# EAGLE design SignalGenerator (EAGLE 7.6.0)
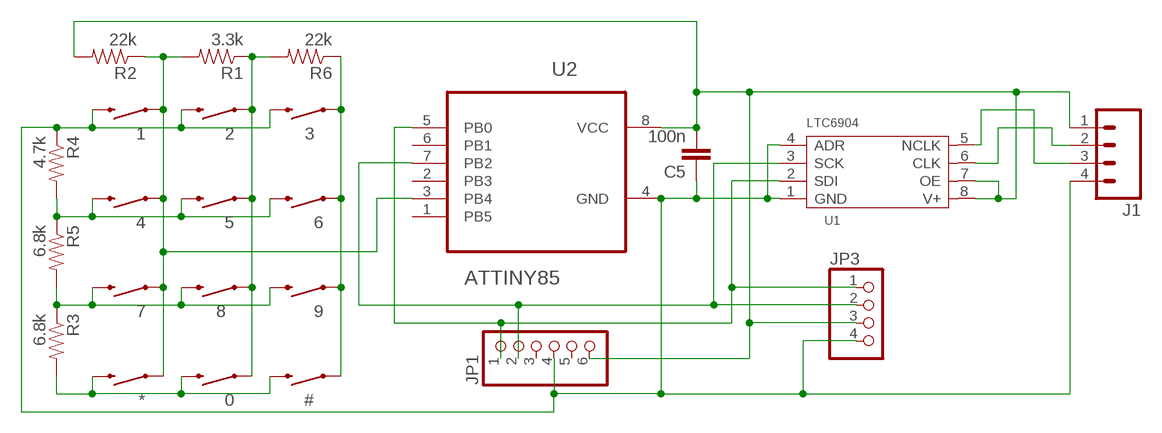
[diagram p0: schematic, sheet 1]

## Parts
0  SWITCH-MOMENTARY-2PTH  [TACTILE-PTH]
1  SWITCH-MOMENTARY-2PTH  [TACTILE-PTH]
2  SWITCH-MOMENTARY-2PTH  [TACTILE-PTH]
3  SWITCH-MOMENTARY-2PTH  [TACTILE-PTH]
4  SWITCH-MOMENTARY-2PTH  [TACTILE-PTH]
5  SWITCH-MOMENTARY-2PTH  [TACTILE-PTH]
6  SWITCH-MOMENTARY-2PTH  [TACTILE-PTH]
7  SWITCH-MOMENTARY-2PTH  [TACTILE-PTH]
8  SWITCH-MOMENTARY-2PTH  [TACTILE-PTH]
9  SWITCH-MOMENTARY-2PTH  [TACTILE-PTH]
#  SWITCH-MOMENTARY-2PTH  [TACTILE-PTH]
*  SWITCH-MOMENTARY-2PTH  [TACTILE-PTH]
C5  100n  CAP0603-CAP  [0603-CAP]
J1  M04SMD_RA_FEMALE  [1X04_SMD_RA_FEMALE]
JP1  HEADER-1X6ROUND  [1X06_ROUND]
JP3  HEADER-1X4ROUND  [1X04_ROUND]
R1  3.3k  0.3OHM-1/8W-1%(0805)  [0805]
R2  22k  0.3OHM-1/8W-1%(0805)  [0805]
R3  6.8k  0.3OHM-1/8W-1%(0805)  [0805]
R4  4.7k  0.3OHM-1/8W-1%(0805)  [0805]
R5  6.8k  0.3OHM-1/8W-1%(0805)  [0805]
R6  22k  0.3OHM-1/8W-1%(0805)  [0805]
U1  LTC6904  AMPLIFIER-INA331DGK(MSOP8)  [MSOP8-0.65-3X3MM]
U2  ATTINY85  ATTINY85-20SU  [SOIC127P798X216-8N]

## Nets
GND: 1.3 2.3 3.3 C5.1 J1.4 JP1.4 JP3.4 R4.1 U1.1(GND) U1.4(ADR) U2.4(GND)
N$1: J1.3 U1.5(NCLK)
N$2: JP1.2 JP3.2 U1.3(SCK) U2.7(PB2)
N$3: J1.2 U1.6(CLK)
N$4: 0.3 #.3 *.3 R3.2
N$6: 4.3 5.3 6.3 R4.2 R5.1
N$7: 7.3 8.3 9.3 R3.1 R5.2
N$8: 1.1 4.1 7.1 *.1 R1.2 R2.1 U2.3(PB4)
N$9: JP1.1 JP3.1 U1.2(SDI) U2.5(PB0)
N$12: 0.1 2.1 5.1 8.1 R1.1 R6.2
N$13: 3.1 6.1 9.1 #.1 R6.1
V+: C5.2 J1.1 JP1.6 JP3.3 R2.2 U1.7(OE) U1.8(V+) U2.8(VCC)
Unconnected: JP1.3 JP1.5 U2.1(PB5) U2.2(PB3) U2.6(PB1)

## Library data of the parts
0 1-9 # * = SparkFun-Electromechanical:SWITCH-MOMENTARY-2: Various NO switches- pushbuttons, reed, etc; PROD_ID: SWCH-08441
C5 = SparkFun-Capacitors:CAP: Capacitor Standard 0603 ceramic capacitor, and 0.1" leaded capacitor.
J1 = SparkFun-Connectors:M04: Header 4 Standard 4-pin 0.1" header. Use with straight break away headers (SKU : PRT-00116), right angle break away headers (PRT-00553), swiss pins (PRT-00743), machine pins (PRT-00117), and female headers (PRT-00115). Molex polarized connector foot print use with SKU : PRT-08231 with associated crimp pins and housings. 1MM SMD Version SKU: PRT-10208
JP1 = microbuilder:HEADER-1X6: PIN HEADER
JP3 = microbuilder:HEADER-1X4: PIN HEADER
R1-R6 = SparkFun-Resistors:0.3OHM-1/8W-1%(0805): RES-11622; PROD_ID: RES-11622; VALUE: 0.3
U1 = technoblogy:AMPLIFIER-INA331DGK(MSOP8): 310020014; MPN: INA331IDGK; VALUE: INA331IDGK-MSOP8
U2 = Atmel_By_element14_Batch_1-00:ATTINY85-20SU: 8-bit Microcontroller with In-System Programmable Flash; MPN: ATTINY85-20SU; OC_FARNELL: 1455164; OC_NEWARK: 58M3797; PACKAGE: SOIC-8; SUPPLIER: Atmel

## Board
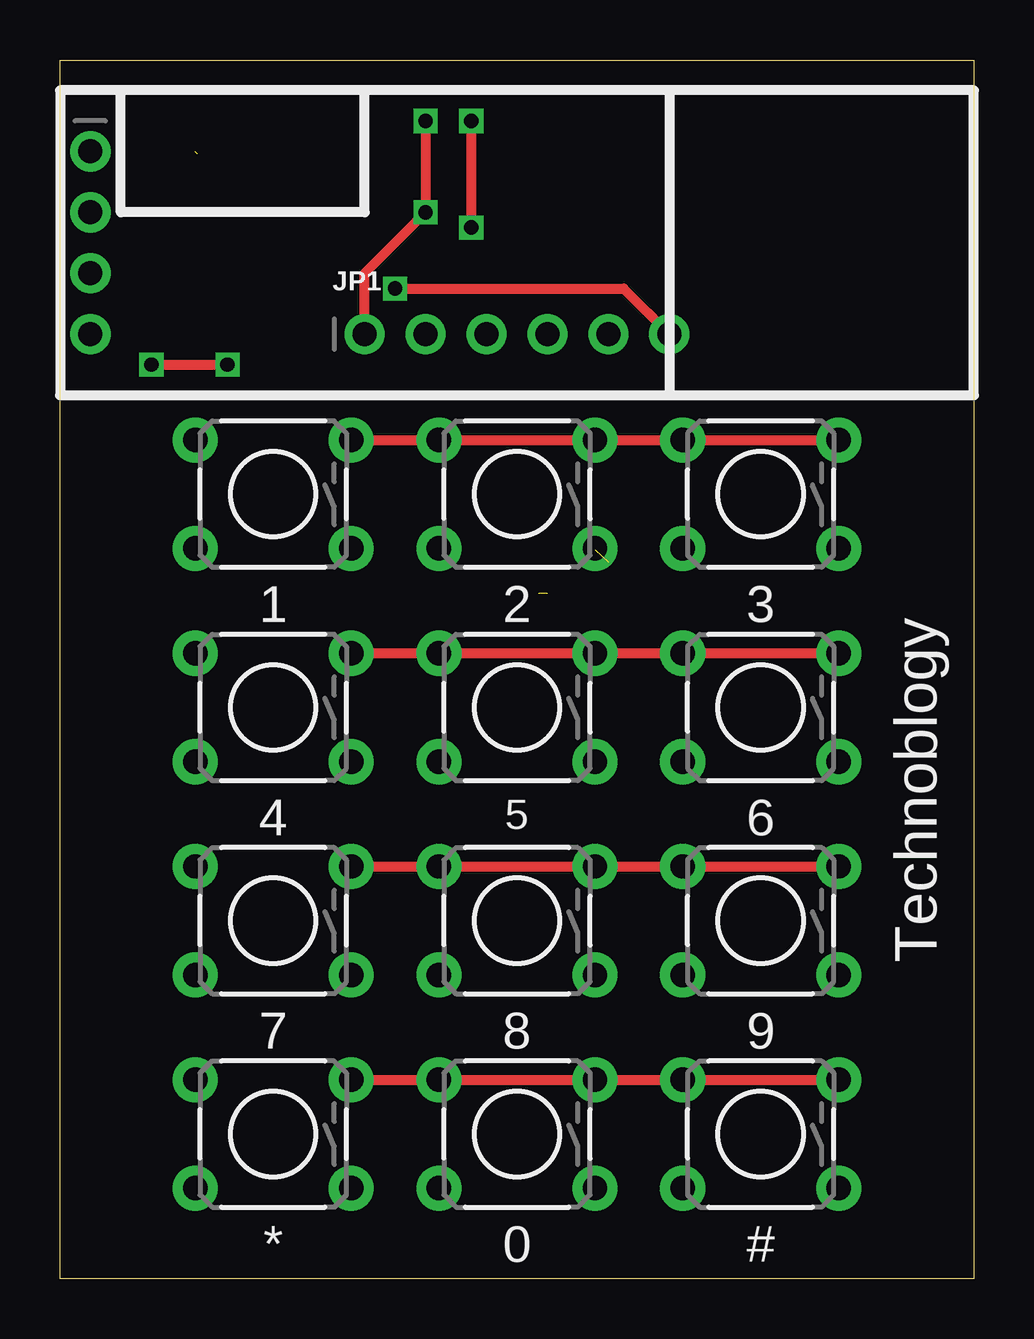
[diagram p1: board, top side]
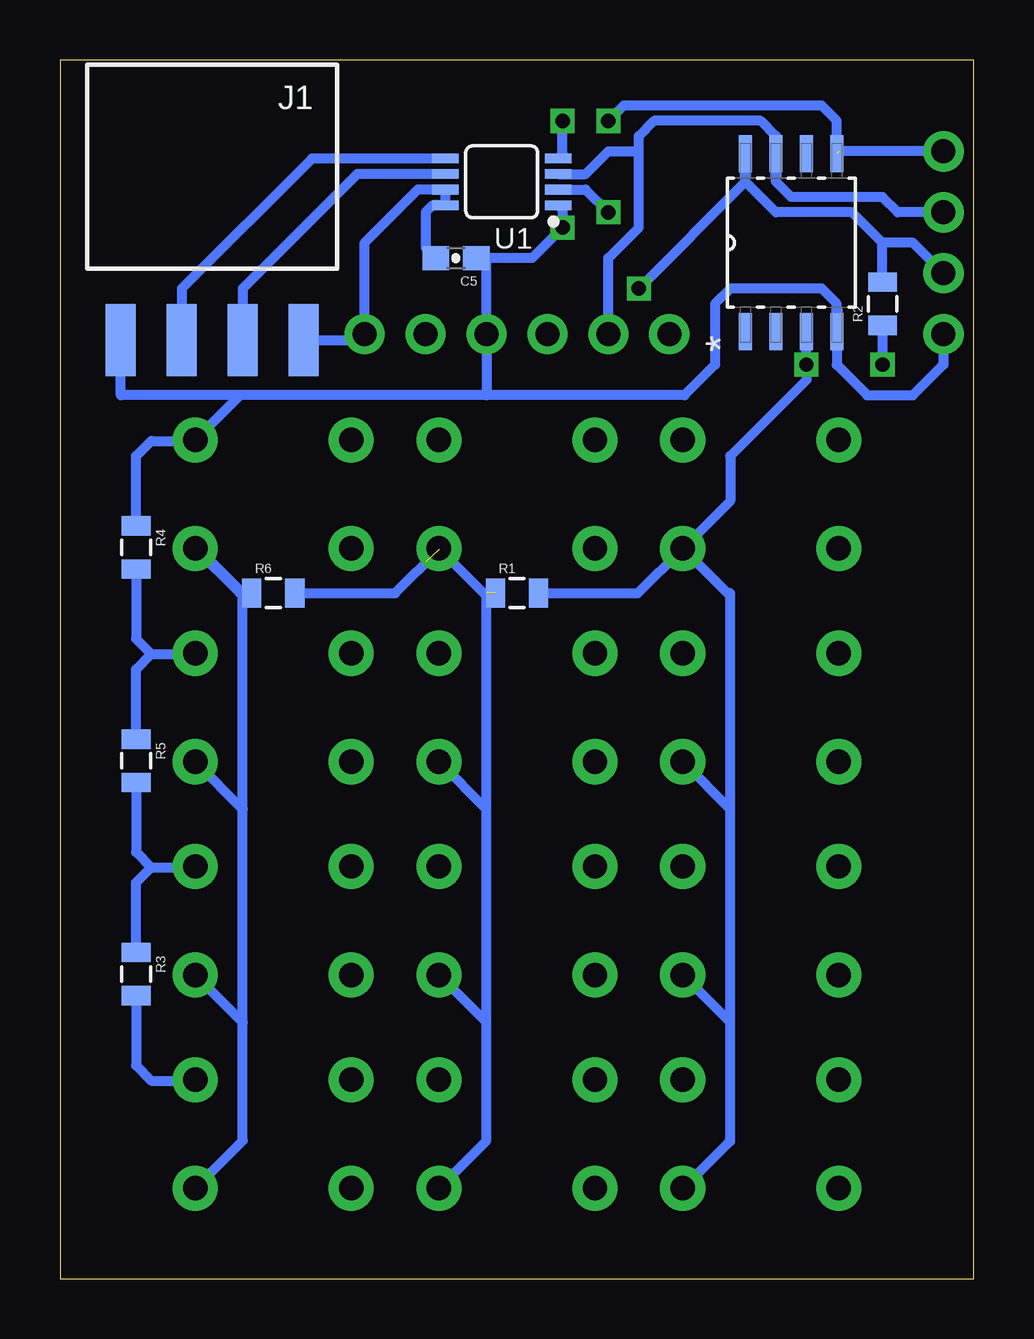
[diagram p2: board, bottom side, seen from below]

Size 38.1 x 50.8 mm. Coordinates in mm from the lower left corner, seen from the top.
Outline: 0,0 0,50.8 38.1,50.8 38.1,0 0,0
Copper layers (1*16): Top 0.035mm / dielectric 1.5mm / Bottom 0.035mm
Design rules "default": minimum track width 10mil, minimum drill 24mil, track to track 8mil, track to pad 8mil, pad to pad 8mil, via to via 8mil, smd to smd 8mil, copper to edge 40mil, drill to drill 8mil, minimum pad ring 10mil, minimum via ring 8mil, stop-mask expansion 4mil, vias tented up to drill 0mil, thermal gap 10mil

### Footprints (pad centres in the part's own frame; a part is rotated, then mirrored left to right if it is on the bottom)
TACTILE-PTH = drill 1.016 pad 1.88: 1 -3.251,2.261; 2 3.251,2.261; 3 -3.251,-2.261; 4 3.251,-2.261
0603-CAP = smd 1.1 x 1: 1 -0.85,0; 2 0.85,0
1X04_SMD_RA_FEMALE = smd 1.25 x 3: 1 -3.81,7.225; 2 -1.27,7.225; 3 1.27,7.225; 4 3.81,7.225
1X06_ROUND = drill 1 pad 1.676: 1 -6.35,0; 2 -3.81,0; 3 -1.27,0; 4 1.27,0; 5 3.81,0; 6 6.35,0
1X04_ROUND = drill 1 pad 1.676: 1 -3.81,0; 2 -1.27,0; 3 1.27,0; 4 3.81,0
0805 = smd 0.8 x 1.2: 1 -0.9,0; 2 0.9,0
MSOP8-0.65-3X3MM = smd 1.1 x 0.4: 1 -2.35,0.975; 2 -2.35,0.325; 3 -2.35,-0.325; 4 -2.35,-0.975; 5 2.35,-0.975; 6 2.35,-0.325; 7 2.35,0.325; 8 2.35,0.975
SOIC127P798X216-8N = smd 1.549 x 0.533: 1 -3.708,1.905; 2 -3.708,0.635; 3 -3.708,-0.635; 4 -3.708,-1.905; 5 3.708,-1.905; 6 3.708,-0.635; 7 3.708,0.635; 8 3.708,1.905

### Placement (x,y rotation side)
0  19.05,6.03 180 top
1  8.89,32.7 180 top
2  19.05,32.7 180 top
3  29.21,32.7 180 top
4  8.89,23.81 180 top
5  19.05,23.81 180 top
6  29.21,23.81 180 top
7  8.89,14.92 180 top
8  19.05,14.92 180 top
9  29.21,14.92 180 top
#  29.21,6.03 180 top
*  8.89,6.03 180 top
C5  21.59,42.55 180 bottom
J1  31.75,46.35 180 bottom
JP1  19.05,39.37 0 top
JP3  1.27,43.18 270 top
R1  19.05,28.57 0 bottom
R2  3.81,40.64 90 bottom
R3  34.92,12.7 270 bottom
R4  34.92,30.48 270 bottom
R5  34.92,21.59 270 bottom
R6  29.21,28.57 0 bottom
U1  19.68,45.72 180 bottom
U2  7.62,43.18 90 bottom

### Tracks (layer width: path | path; a pad name or v marks a point on that pad's centre or on a via)
GND  (via drill 0.6)
  Top 0.406: 1.3 2.3 3.3 | v17.14,48.26 v17.14,43.81
  Bottom 0.406: 20.32,36.83 JP1.4 20.32,42.55 C5.1 18.41,42.55 v17.14,43.81 17.14,44.55 U1.1 | 30.59,36.83 35.56,36.83 J1.4 | R4.1 34.92,34.29 34.29,34.92 32.5,34.92 3.3 30.59,36.83 | 20.32,36.83 30.59,36.83 | JP3.4 1.27,38.1 2.54,36.83 4.45,36.83 5.71,38.1 U2.4 5.71,40.64 6.35,41.27 10.16,41.27 10.79,40.64 10.79,38.1 12.06,36.83 20.32,36.83 | U1.4 17.14,46.88 v17.14,48.26
N$1
  Bottom 0.406: U1.5 27.6,46.7 33.02,41.27 J1.3
N$2
  Bottom 0.406: JP1.2 15.24,42.55 13.97,43.81 13.97,46.99 | JP3.2 3.17,44.45 3.81,45.09 7.62,45.09 8.26,45.72 U2.7 8.26,47.62 8.89,48.26 13.34,48.26 13.97,47.62 13.97,46.99 | U1.3 16.18,46.05 15.24,46.99 13.97,46.99
N$3
  Bottom 0.406: U1.6 25.71,46.05 30.48,41.27 J1.2
N$4
  Top 0.406: *.3 0.3 #.3
  Bottom 0.406: R3.2 34.92,8.89 34.29,8.26 32.5,8.26 #.3
N$6
  Top 0.406: 4.3 5.3 6.3
  Bottom 0.406: R5.1 34.92,25.4 34.29,26.04 | 34.29,26.04 32.5,26.04 6.3 | R4.2 34.92,26.67 34.29,26.04
N$7
  Top 0.406: 7.3 8.3 9.3
  Bottom 0.406: R3.1 34.92,16.51 34.29,17.14 | 34.29,17.14 32.5,17.14 9.3 | R5.2 34.92,17.78 34.29,17.14
N$8  (via drill 0.6)
  Top 0.406: v3.81,38.1 v6.99,38.1
  Bottom 0.406: 10.16,10.68 10.16,5.71 10.2,5.71 *.1 | 10.16,10.68 10.16,19.57 | 10.16,19.57 10.16,28.57 10.27,28.57 1.1 | 7.1 10.16,10.68 | 4.1 10.16,19.57 | R1.2 14.01,28.57 1.1 | 1.1 10.16,32.42 10.16,34.29 6.99,37.47 v6.99,38.1 U2.3 | R2.1 v3.81,38.1
N$9  (via drill 0.6)  (1 unrouted)
  Top 0.406: v15.24,48.26 v15.24,44.45 12.7,41.91 JP1.1
  Bottom 0.406: JP3.1 5.61,46.99 | v15.24,48.26 14.61,48.9 6.35,48.9 5.71,48.26 U2.5 | U1.2 16.18,45.4 v15.24,44.45
N$12  (2 unrouted)
  Bottom 0.406: 0.1 20.32,5.75 20.32,10.68 | 20.32,10.68 20.32,19.57 | 20.32,19.57 20.32,28.46 | 20.32,28.46 20.32,28.57 | 5.1 20.32,19.57 | 8.1 20.32,10.68 | R6.2 24.13,28.57 22.3,30.4 2.1 20.32,28.46 | 22.86,29.84 22.86,29.88
N$13
  Bottom 0.406: #.1 30.48,5.75 30.48,10.68 | 30.48,10.68 30.48,19.57 | 30.48,19.57 30.48,28.57 32.35,30.44 3.1 30.59,28.57 R6.1 | 6.1 30.48,19.57 | 9.1 30.48,10.68
V+  (via drill 0.6)
  Top 0.406: v13.97,41.27 23.5,41.27 JP1.6
  Bottom 0.406: J1.1 25.64,39.13 JP1.6 25.4,43.18 23.18,45.4 U1.7 U1.8 22.57,44.74 22.86,44.45 22.86,42.97 C5.2 | JP3.3 2.54,43.18 3.81,43.18 | 3.81,43.18 5.08,44.45 8.26,44.45 9.53,45.72 | 9.53,45.72 U2.8 | R2.2 3.81,43.18 | v13.97,41.27 9.53,45.72

### Text on the board
tPlace: Technoblogy